# EAGLE schematic PowerCapV2 (EAGLE 7.6.0)
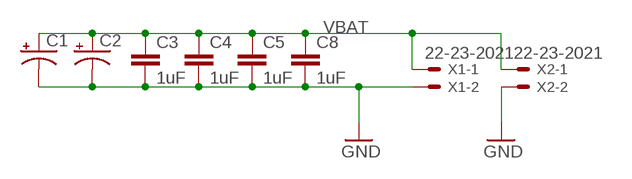
[diagram p0: schematic, sheet 1]

## Parts
C1  CAP_POLPTH4  [CPOL-RADIAL-1000UF-25V]
C2  CAP_POLPTH4  [CPOL-RADIAL-1000UF-25V]
C3  1uF  1UF-25V-10%(0805)"  [0805-CAP]
C4  1uF  1UF-25V-10%(0805)"  [0805-CAP]
C5  1uF  1UF-25V-10%(0805)"  [0805-CAP]
C8  1uF  1UF-25V-10%(0805)"  [0805-CAP]
X1  22-23-2021  [22-23-2021]
X2  22-23-2021  [22-23-2021]

## Nets
GND: C1.- C2.- C3.2 C4.2 C5.2 C8.2 X1.2 X2.2
VBAT: C1.+ C2.+ C3.1 C4.1 C5.1 C8.1 X1.1 X2.1

## Library data of the parts
C1 C2 = SparkFun-Capacitors:CAP_POL: Capacitor Polarized These are standard SMD and PTH capacitors. Normally 10uF, 47uF, and 100uF in electrolytic and tantalum varieties. Always verify the external diameter of the through hole cap, it varies with capacity, voltage, and manufacturer. The EIA devices should be standard.
C3-C5 C8 = SparkFun-Capacitors:1UF-25V-10%(0805): CAP-08064
X1 X2 = con-molex:22-23-2021: .100" (2.54mm) Center Header - 2 Pin; MF: MOLEX; MPN: 22-23-2021; OC_FARNELL: 1462926; OC_NEWARK: 25C3832